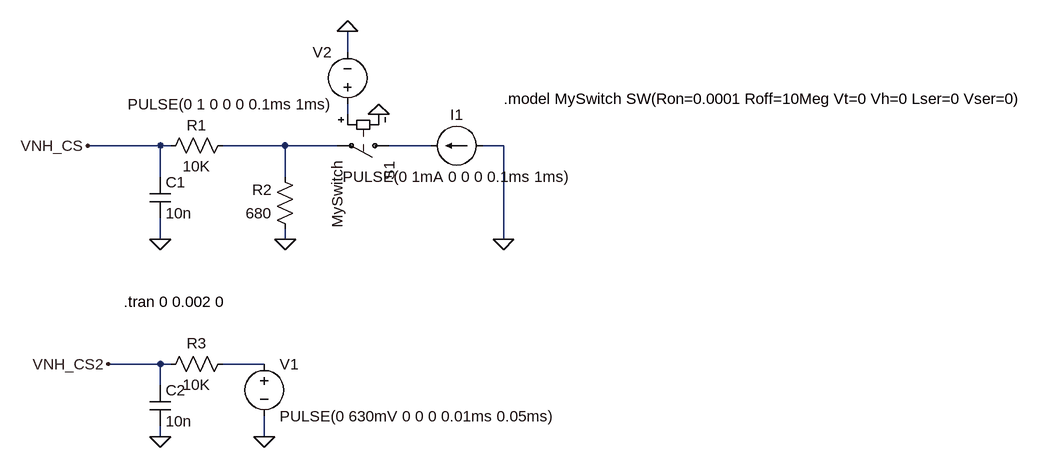
[diagram p0: schematic VNH Current sense.asc]
VNH Current sense.asc, the LTspice schematic file:
Version 4
SHEET 1 1436 680
WIRE 320 -32 320 -64
WIRE 320 64 320 48
WIRE 32 112 -80 112
WIRE 48 112 32 112
WIRE 224 112 128 112
WIRE 304 112 224 112
WIRE 448 112 384 112
WIRE 560 112 528 112
WIRE 32 160 32 112
WIRE 224 160 224 112
WIRE 32 256 32 224
WIRE 224 256 224 240
WIRE 560 256 560 112
WIRE 32 448 -48 448
WIRE 48 448 32 448
WIRE 192 448 128 448
WIRE 32 480 32 448
WIRE 32 560 32 544
WIRE 192 560 192 528
FLAG 32 256 0
FLAG 224 256 0
FLAG -80 112 VNH_CS
FLAG 32 560 0
FLAG 192 560 0
FLAG -48 448 VNH_CS2
FLAG 560 256 0
FLAG 368 64 0
FLAG 320 -64 0
SYMBOL cap 16 160 R0
SYMATTR InstName C1
SYMATTR Value 10n
SYMBOL res 144 96 R90
WINDOW 0 0 56 VBottom 2
WINDOW 3 32 56 VTop 2
SYMATTR InstName R1
SYMATTR Value 10K
SYMBOL res 240 256 R180
WINDOW 0 36 76 Left 2
WINDOW 3 36 40 Left 2
SYMATTR InstName R2
SYMATTR Value 680
SYMBOL current 528 112 R90
WINDOW 0 -32 40 VBottom 2
WINDOW 3 32 40 VTop 2
WINDOW 123 0 0 Left 0
WINDOW 39 0 0 Left 0
SYMATTR InstName I1
SYMATTR Value PULSE(0 1mA 0 0 0 0.1ms 1ms)
SYMBOL res 144 432 R90
WINDOW 0 0 56 VBottom 2
WINDOW 3 32 56 VTop 2
SYMATTR InstName R3
SYMATTR Value 10K
SYMBOL cap 16 480 R0
SYMATTR InstName C2
SYMATTR Value 10n
SYMBOL voltage 192 432 R0
WINDOW 123 0 0 Left 0
WINDOW 39 0 0 Left 0
SYMATTR InstName V1
SYMATTR Value PULSE(0 630mV 0 0 0 0.01ms 0.05ms)
SYMBOL sw 400 112 R90
SYMATTR InstName S1
SYMATTR Value MySwitch
SYMBOL voltage 320 64 R180
WINDOW 0 24 96 Left 2
WINDOW 3 24 16 Left 2
WINDOW 123 0 0 Left 0
WINDOW 39 0 0 Left 0
SYMATTR InstName V2
SYMATTR Value PULSE(0 1 0 0 0 0.1ms 1ms)
TEXT -24 352 Left 2 !.tran 0 0.002 0
TEXT 560 40 Left 2 !.model MySwitch SW(Ron=0.0001 Roff=10Meg Vt=0 Vh=0 Lser=0 Vser=0)

The netlist it stands for:
* VNH Current sense.asc
C1 VNH_CS 0 10n
R1 N002 VNH_CS 10K
R2 0 N002 680
I1 0 N003 PULSE(0 1mA 0 0 0 0.1ms 1ms)
R3 N004 VNH_CS2 10K
C2 VNH_CS2 0 10n
V1 N004 0 PULSE(0 630mV 0 0 0 0.01ms 0.05ms)
S1 N003 N002 N001 0 MySwitch
V2 N001 0 PULSE(0 1 0 0 0 0.1ms 1ms)
.tran 0 0.002 0
.model MySwitch SW(Ron=0.0001 Roff=10Meg Vt=0 Vh=0 Lser=0 Vser=0)
.backanno
.end